# Altium project 4501-WB_AV_BMS_REV_A1.PrjPCB
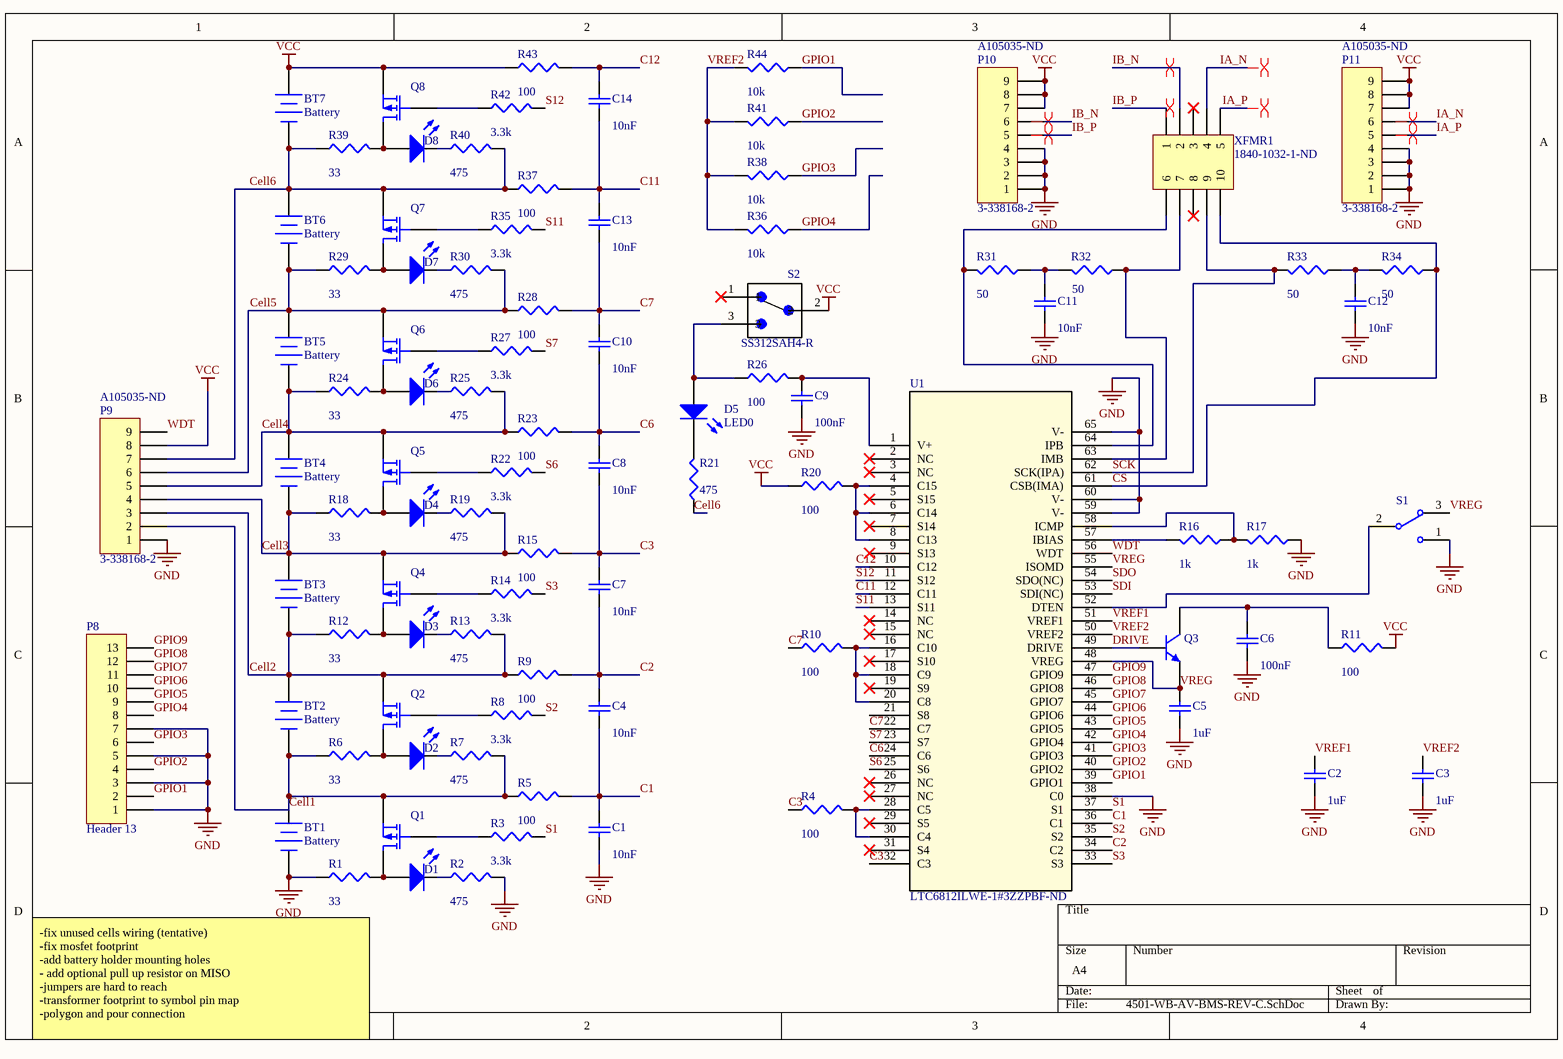
[diagram p0: 4501-WB-AV-BMS-REV-C.SchDoc]
1 sheet, 89 parts. Net scope: global (net labels, ports and power ports of the same name join across sheets).
Board file: 4501-WB-AV-BMS-REV-C.PcbDoc

## Sheet 4501-WB-AV-BMS-REV-C.SchDoc
size A4

### Parts
BT1  Battery  [1043_KEY]
BT2  Battery  [1043_KEY]
BT3  Battery  [1043_KEY]
BT4  Battery  [1043_KEY]
BT5  Battery  [1043_KEY]
BT6  Battery  [1043_KEY]
BT7  Battery  [1043_KEY]
C1  value 10nF  [1608[0603]]  (hidden comment: 399-1092-1-ND)
C2  value 1uF  [6-0805_N]  (hidden comment: 311-3498-1-ND)
C3  value 1uF  [6-0805_N]  (hidden comment: 311-3498-1-ND)
C4  value 10nF  [1608[0603]]  (hidden comment: 399-1092-1-ND)
C5  value 1uF  [6-0805_N]  (hidden comment: 311-3498-1-ND)
C6  value 100nF  [6-0805_N]  (hidden comment: 1276-1090-1-ND)
C7  value 10nF  [1608[0603]]  (hidden comment: 399-1092-1-ND)
C8  value 10nF  [1608[0603]]  (hidden comment: 399-1092-1-ND)
C9  value 100nF  [6-0805_N]  (hidden comment: 1276-1090-1-ND)
C10  value 10nF  [1608[0603]]  (hidden comment: 399-1092-1-ND)
C11  value 10nF  [1608[0603]]  (hidden comment: 399-1092-1-ND)
C12  value 10nF  [1608[0603]]  (hidden comment: 399-1092-1-ND)
C13  value 10nF  [1608[0603]]  (hidden comment: 399-1092-1-ND)
C14  value 10nF  [1608[0603]]  (hidden comment: 399-1092-1-ND)
D1  160-1435-1-ND  [J1-0603]  (value not drawn)
D2  160-1435-1-ND  [J1-0603]  (value not drawn)
D3  160-1435-1-ND  [J1-0603]  (value not drawn)
D4  160-1435-1-ND  [J1-0603]  (value not drawn)
D5  LED0  [J1-0603]
D6  160-1435-1-ND  [J1-0603]  (value not drawn)
D7  160-1435-1-ND  [J1-0603]  (value not drawn)
D8  160-1435-1-ND  [J1-0603]  (value not drawn)
P8  Header 13  [DIP10]
P9  3-338168-2  Supplier Part Number 1: A105035-ND  [CONN_3-338168-2]
P10  3-338168-2  Supplier Part Number 1: A105035-ND  [CONN_3-338168-2]
P11  3-338168-2  Supplier Part Number 1: A105035-ND  [CONN_3-338168-2]
Q1  BSS308PEH6327XTSA1CT-ND  [SOT95P245X110-3N]  (value not drawn)
Q2  BSS308PEH6327XTSA1CT-ND  [SOT95P245X110-3N]  (value not drawn)
Q3  DXT5551P5-13CT-ND  [DXT5551P5-13]  (value not drawn)
Q4  BSS308PEH6327XTSA1CT-ND  [SOT95P245X110-3N]  (value not drawn)
Q5  BSS308PEH6327XTSA1CT-ND  [SOT95P245X110-3N]  (value not drawn)
Q6  BSS308PEH6327XTSA1CT-ND  [SOT95P245X110-3N]  (value not drawn)
Q7  BSS308PEH6327XTSA1CT-ND  [SOT95P245X110-3N]  (value not drawn)
Q8  BSS308PEH6327XTSA1CT-ND  [SOT95P245X110-3N]  (value not drawn)
R1  value 33  [12Z-2010]  (hidden comment: A130642CT-ND)
R2  value 475  [J1-0603]  (hidden comment: RMCF2010JT33R0CT-ND)
R3  value 3.3k  [J1-0603]  (hidden comment: A129543CT-ND)
R4  value 100  [J1-0603]  (hidden comment: A129676CT-ND)
R5  value 100  [J1-0603]  (hidden comment: A129676CT-ND)
R6  value 33  [12Z-2010]  (hidden comment: A130642CT-ND)
R7  value 475  [J1-0603]  (hidden comment: RMCF2010JT33R0CT-ND)
R8  value 3.3k  [J1-0603]  (hidden comment: A129543CT-ND)
R9  value 100  [J1-0603]  (hidden comment: A129676CT-ND)
R10  value 100  [J1-0603]  (hidden comment: A129676CT-ND)
R11  value 100  [J1-0603]  (hidden comment: A129676CT-ND)
R12  value 33  [12Z-2010]  (hidden comment: A130642CT-ND)
R13  value 475  [J1-0603]  (hidden comment: RMCF2010JT33R0CT-ND)
R14  value 3.3k  [J1-0603]  (hidden comment: A129543CT-ND)
R15  value 100  [J1-0603]  (hidden comment: A129676CT-ND)
R16  value 1k  [J1-0603]  (hidden comment: RNCP0603FTD1K00CT-ND)
R17  value 1k  [J1-0603]  (hidden comment: RNCP0603FTD1K00CT-ND)
R18  value 33  [12Z-2010]  (hidden comment: A130642CT-ND)
R19  value 475  [J1-0603]  (hidden comment: RMCF2010JT33R0CT-ND)
R20  value 100  [J1-0603]  (hidden comment: A129676CT-ND)
R21  value 475  [J1-0603]  (hidden comment: RMCF2010JT33R0CT-ND)
R22  value 3.3k  [J1-0603]  (hidden comment: A129543CT-ND)
R23  value 100  [J1-0603]  (hidden comment: A129676CT-ND)
R24  value 33  [12Z-2010]  (hidden comment: A130642CT-ND)
R25  value 475  [J1-0603]  (hidden comment: RMCF2010JT33R0CT-ND)
R26  value 100  [J1-0603]  (hidden comment: A129676CT-ND)
R27  value 3.3k  [J1-0603]  (hidden comment: A129543CT-ND)
R28  value 100  [J1-0603]  (hidden comment: A129676CT-ND)
R29  value 33  [12Z-2010]  (hidden comment: A130642CT-ND)
R30  value 475  [J1-0603]  (hidden comment: RMCF2010JT33R0CT-ND)
R31  value 50  [J1-0603]  (hidden comment: 311-2598-1-ND)
R32  value 50  [J1-0603]  (hidden comment: 311-2598-1-ND)
R33  value 50  [J1-0603]  (hidden comment: 311-2598-1-ND)
R34  value 50  [J1-0603]  (hidden comment: 311-2598-1-ND)
R35  value 3.3k  [J1-0603]  (hidden comment: A129543CT-ND)
R36  value 10k  [J1-0603]  (hidden comment: RNCP0603FTD10K0CT-ND)
R37  value 100  [J1-0603]  (hidden comment: A129676CT-ND)
R38  value 10k  [J1-0603]  (hidden comment: RNCP0603FTD10K0CT-ND)
R39  value 33  [12Z-2010]  (hidden comment: A130642CT-ND)
R40  value 475  [J1-0603]  (hidden comment: RMCF2010JT33R0CT-ND)
R41  value 10k  [J1-0603]  (hidden comment: RNCP0603FTD10K0CT-ND)
R42  value 3.3k  [J1-0603]  (hidden comment: A129543CT-ND)
R43  value 100  [J1-0603]  (hidden comment: A129676CT-ND)
R44  value 10k  [J1-0603]  (hidden comment: RNCP0603FTD10K0CT-ND)
S1  S9337-ND, SAM8981-ND  [*TSM-103-01-L-SV]  (value not drawn)
S2  SS312SAH4-R  [*SW_SS312SAH4-R]
U1  LTC6812ILWE-1#3ZZPBF-ND  [LQFP64_LWE_A - duplicate]
XFMR1  1840-1032-1-ND  [HM2100NLT]

### Nets
GND: BT1.2(-) C1.1 C2.1 C3.1 C5.1 C6.1 C9.1 C11.1 C12.1 P8.1 P8.3 P8.5 P8.7 P9.1 P10.1 P10.2 P10.3 P10.4 P11.1 P11.2 P11.3 P11.4 R1.2 R2.1 R17.2 S1.1 U1.38(C0) U1.59(V-) U1.60(V-) U1.65(V-)
VCC: BT7.1(+) P9.8 P10.7 P10.8 P10.9 P11.7 P11.8 P11.9 Q8.3(S) R11.2 R20.1 R43.1 S2.2
C1: C1.2 C4.1 R5.2 U1.36(C1)
C2: C4.2 C7.1 R9.2 U1.34(C2)
C3: C7.2 C8.1 R4.1 R15.2 U1.32(C3)
C6: C8.2 C10.1 R23.2 U1.24(C6)
C7: C10.2 C13.1 R10.1 R28.2 U1.22(C7)
C11: C13.2 C14.1 R37.2 U1.12(C11)
C12: C14.2 R43.2 U1.10(C12)
Cell1: BT1.1(+) BT2.2(-) P9.2 Q1.3(S) R5.1 R6.2 R7.1
Cell2: BT2.1(+) BT3.2(-) P9.3 Q2.3(S) R9.1 R12.2 R13.1
Cell3: BT3.1(+) BT4.2(-) P9.4 Q4.3(S) R15.1 R18.2 R19.1
Cell4: BT4.1(+) BT5.2(-) P9.5 Q5.3(S) R23.1 R24.2 R25.1
Cell5: BT5.1(+) BT6.2(-) P9.6 Q6.3(S) R28.1 R29.2 R30.1
Cell6: BT6.1(+) BT7.2(-) P9.7 Q7.3(S) R21.2 R37.1 R39.2 R40.1
CS: R34.2 U1.61(CSB(IMA)) XFMR1.10
DRIVE: Q3.2(B) U1.49(DRIVE)
GPIO1: P8.2 R44.2 U1.39(GPIO1)
GPIO2: P8.4 R41.2 U1.40(GPIO2)
GPIO3: P8.6 R38.2 U1.41(GPIO3)
GPIO4: P8.8 R36.2 U1.42(GPIO4)
GPIO5: P8.9 U1.43(GPIO5)
GPIO6: P8.10 U1.44(GPIO6)
GPIO7: P8.11 U1.45(GPIO7)
GPIO8: P8.12 U1.46(GPIO8)
GPIO9: P8.13 U1.47(GPIO9)
IA_N: P11.6 XFMR1.4
IA_P: P11.5 XFMR1.5
IB_N: P10.6 XFMR1.2
IB_P: P10.5 XFMR1.1
S1: R3.2 U1.37(S1)
S2: R8.2 U1.35(S2)
S3: R14.2 U1.33(S3)
S6: R22.2 U1.25(S6)
S7: R27.2 U1.23(S7)
S11: R35.2 U1.13(S11)
S12: R42.2 U1.11(S12)
SCK: R33.1 U1.62(SCK(IPA)) XFMR1.9
SDI: U1.53(SDI(NC))
SDO: U1.54(SDO(NC))
VREF1: C2.2 U1.51(VREF1)
VREF2: C3.2 R36.1 R38.1 R41.1 R44.1 U1.50(VREF2)
VREG: C5.2 Q3.1(E) S1.3 U1.48(VREG) U1.55(ISOMD)
WDT: P9.9 U1.56(WDT)
NetC6_2: C6.2 Q3.3(C) R11.1
NetC9_2: C9.2 R26.1 U1.1(V+)
NetC11_2: C11.2 R31.2 R32.1
NetC12_2: C12.2 R33.2 R34.1
NetD1_1: D1.1(A) Q1.1(D) R1.1
NetD1_2: D1.2(K) R2.2
NetD2_1: D2.1(A) Q2.1(D) R6.1
NetD2_2: D2.2(K) R7.2
NetD3_1: D3.1(A) Q4.1(D) R12.1
NetD3_2: D3.2(K) R13.2
NetD4_1: D4.1(A) Q5.1(D) R18.1
NetD4_2: D4.2(K) R19.2
NetD5_1: D5.1(A) R26.2 S2.3
NetD5_2: D5.2(K) R21.1
NetD6_1: D6.1(A) Q6.1(D) R24.1
NetD6_2: D6.2(K) R25.2
NetD7_1: D7.1(A) Q7.1(D) R29.1
NetD7_2: D7.2(K) R30.2
NetD8_1: D8.1(A) Q8.1(D) R39.1
NetD8_2: D8.2(K) R40.2
NetQ1_2: Q1.2(G) R3.1
NetQ2_2: Q2.2(G) R8.1
NetQ4_2: Q4.2(G) R14.1
NetQ5_2: Q5.2(G) R22.1
NetQ6_2: Q6.2(G) R27.1
NetQ7_2: Q7.2(G) R35.1
NetQ8_2: Q8.2(G) R42.1
NetR4_2: R4.2 U1.28(C5) U1.30(C4)
NetR10_2: R10.2 U1.16(C10) U1.18(C9) U1.20(C8)
NetR16_1: R16.1 U1.57(IBIAS)
NetR16_2: R16.2 R17.1 U1.58(ICMP)
NetR20_2: R20.2 U1.4(C15) U1.6(C14) U1.8(C13)
NetR31_1: R31.1 U1.64(IPB) XFMR1.6
NetR32_2: R32.2 U1.63(IMB) XFMR1.7
NetS1_2: S1.2 U1.52(DTEN)

Not connected (* = marked no-connect by the designer): S2 1*; U1 2(NC)* 3(NC)* 5(S15)* 7(S14)* 9(S13)* 14(NC)* 15(NC)* 17(S10)* 19(S9)* 21(S8) 26(NC)* 27(NC)* 29(S5)* 31(S4)*; XFMR1 3* 8*

### Layout directives
differential pair: (no net found under the mark), IA_N, IA_P, IB_N, IB_P

### Notes on the sheet
- -fix unused cells wiring (tentative)
  -fix mosfet footprint
  -add battery holder mounting holes
  - add optional pull up resistor on MISO
  -jumpers are hard to reach
  -transformer footprint to symbol pin map
  -polygon and pour connection

### Library data of the parts
BT1-BT7 = Battery: Multicell Battery; Published: 24-Mar-1999; LatestRevisionDate: 17-Jul-2002; LatestRevisionNote: Re-released for DXP Platform.; PackageReference: BAT-2; Publisher: Altium Limited; PackageDescription: Battery; 2 Leads
C1-C14 = Cap Semi: Capacitor (Semiconductor SIM Model); Published: 8-Jun-2000; LatestRevisionDate: 29-May-2009; LatestRevisionNote: IPC-7351 Footprint Added.; PackageReference: C1206; Publisher: Altium Limited; PackageDescription: Chip Capacitor
  C1 C4 C7 C8 C10-C14: SPN: 399-1092-1-ND
  C2 C3 C5: SPN: 311-3498-1-ND
  C6 C9: SPN: 1276-1090-1-ND
D1-D4 D6-D8 = LED0: Typical INFRARED GaAs LED; Published: 8-Jun-2000; LatestRevisionDate: 08-Jul-2005; LatestRevisionNote: Mech Layer 1 removed.; PackageReference: LED-0; Publisher: Altium Limited; PackageDescription: LED; 2 Leads; SPN: 160-1435-1-ND
D5 = LED0: Typical INFRARED GaAs LED; SPN: 160-1646-1-ND; Published: 8-Jun-2000; LatestRevisionDate: 08-Jul-2005; LatestRevisionNote: Mech Layer 1 removed.; PackageReference: LED-0; Publisher: Altium Limited; PackageDescription: LED; 2 Leads
P8 = Header 13: Header, 13-Pin; LatestRevisionDate: 17-Jul-2002; LatestRevisionNote: Re-released for DXP Platform.; Publisher: Altium Limited
P9-P11 = Header 9: Header, 9-Pin; LatestRevisionDate: 17-Jul-2002; LatestRevisionNote: Re-released for DXP Platform.; Publisher: Altium Limited; MPN: 3-338168-2; SPN: A105035-ND; Supplier 1: Digi-Key
Q1 Q2 Q4-Q8 = MOSFET-P: P-Channel MOSFET; pin to pad: 1>3 2>1 3>2; Published: 8-Jun-2000; LatestRevisionDate: 17-Jul-2002; LatestRevisionNote: Re-released for DXP Platform.; PackageVersion: 1995/1996; PackageReference: E3; Publisher: Altium Limited; PackageDescription: TO, Flat Index; 3 In-Line, Axial Leads; Body Dia. 4.6mm; Lead Dia. 0.5 mm (max); SPN: BSS308PEH6327XTSA1CT-ND
Q3 = 2N3904: NPN General Purpose Amplifier; Published: 8-Jun-2000; LatestRevisionDate: 15-Jan-2003; LatestRevisionNote: PCB Footprint 'BCY-W3/D4.7' replaced; DatasheetVersion: 1997; PackageVersion: Sep-1998; PackageReference: TO-92A; Publisher: Altium Limited; PackageDescription: TO, Flat Index; 3 In-Line, Axial Leads; Body Dia. 4.5mm; Leads 0.51 x 0.48 mm (max); ComponentLink1Description: Manufacturer Link; ComponentLink1URL: http://www.fairchildsemi.com/; ComponentLink2Description: Datasheet; ComponentLink2URL: http://www.fairchildsemi.com/ds/2N%2F2N3904.pdf; SPN: DXT5551P5-13CT-ND
R1-R44 = Res3: Resistor; Published: 8-Jun-2000; LatestRevisionDate: 29-May-2009; LatestRevisionNote: IPC-7351 Footprint Added.; PackageReference: J1-0603; Publisher: Altium Limited; PackageDescription: Chip Resistor
  R1 R6 R12 R18 R24 R29 R39: SPN: A130642CT-ND
  R2 R7 R13 R19 R21 R25 R30 R40: SPN: RMCF2010JT33R0CT-ND
  R3 R8 R14 R22 R27 R35 R42: SPN: A129543CT-ND
  R4 R5 R9 R11 R15 R20 R23 R26 R28 R37 R43: Parameter 1: A129676CT-ND; SPN: A129676CT-ND
  R10: SPN: A129676CT-ND
  R16 R17: SPN: RNCP0603FTD1K00CT-ND
  R31-R34: SPN: 311-2598-1-ND
  R36 R38 R41 R44: SPN: RNCP0603FTD10K0CT-ND
S1 = SW-SPDT: SPDT Subminiature Toggle Switch, Right Angle Mounting, Vertical Actuation; Published: 24-Mar-1999; LatestRevisionDate: 17-Dec-2003; LatestRevisionNote: Schematic revised, PCB Footprint replaced.; DatasheetVersion: 05-Dec-2000; PackageReference: TL36WW15050; Publisher: Altium Limited; PackageDescription: Switch; 4 Leads; ComponentLink1Description: Manufacturer Link; ComponentLink1URL: http://www.apem.com; SPN: S9337-ND, SAM8981-ND
S2 = SS312SAH4-R: Switch Slide ON None ON SPDT Side Slide 0.1A 28VAC 28VDC 0.4VA 10000Cycles Gull Wing SMD T/R; MF: NKK Switches; SPN: ‎360-2924-1-ND‎; Package: None; MP: SS312SAH4-R; SnapEDA_Link: https://www.snapeda.com/parts/SS312SAH4-R/NKK%20Switches/view-part/?ref=snap; Price: None; Availability: Unavailable; Value: *
U1 = LTC6812HLWE-1: No Description Available; Copyright: Copyright (C) 2018 Accelerated Designs. All rights reserved; RefDes: RefDes; Type: DEV; Value: Value; SPN: LTC6812ILWE-1#3ZZPBF-ND
XFMR1 = Header 5X2A: Header, 5-Pin, Dual row / HM2100NLT; LatestRevisionDate: 17-Jul-2002; LatestRevisionNote: Re-released for DXP Platform.; Publisher: Altium Limited; SPN: 1840-1032-1-ND